# Altium project PreRegulator.PrjPcb
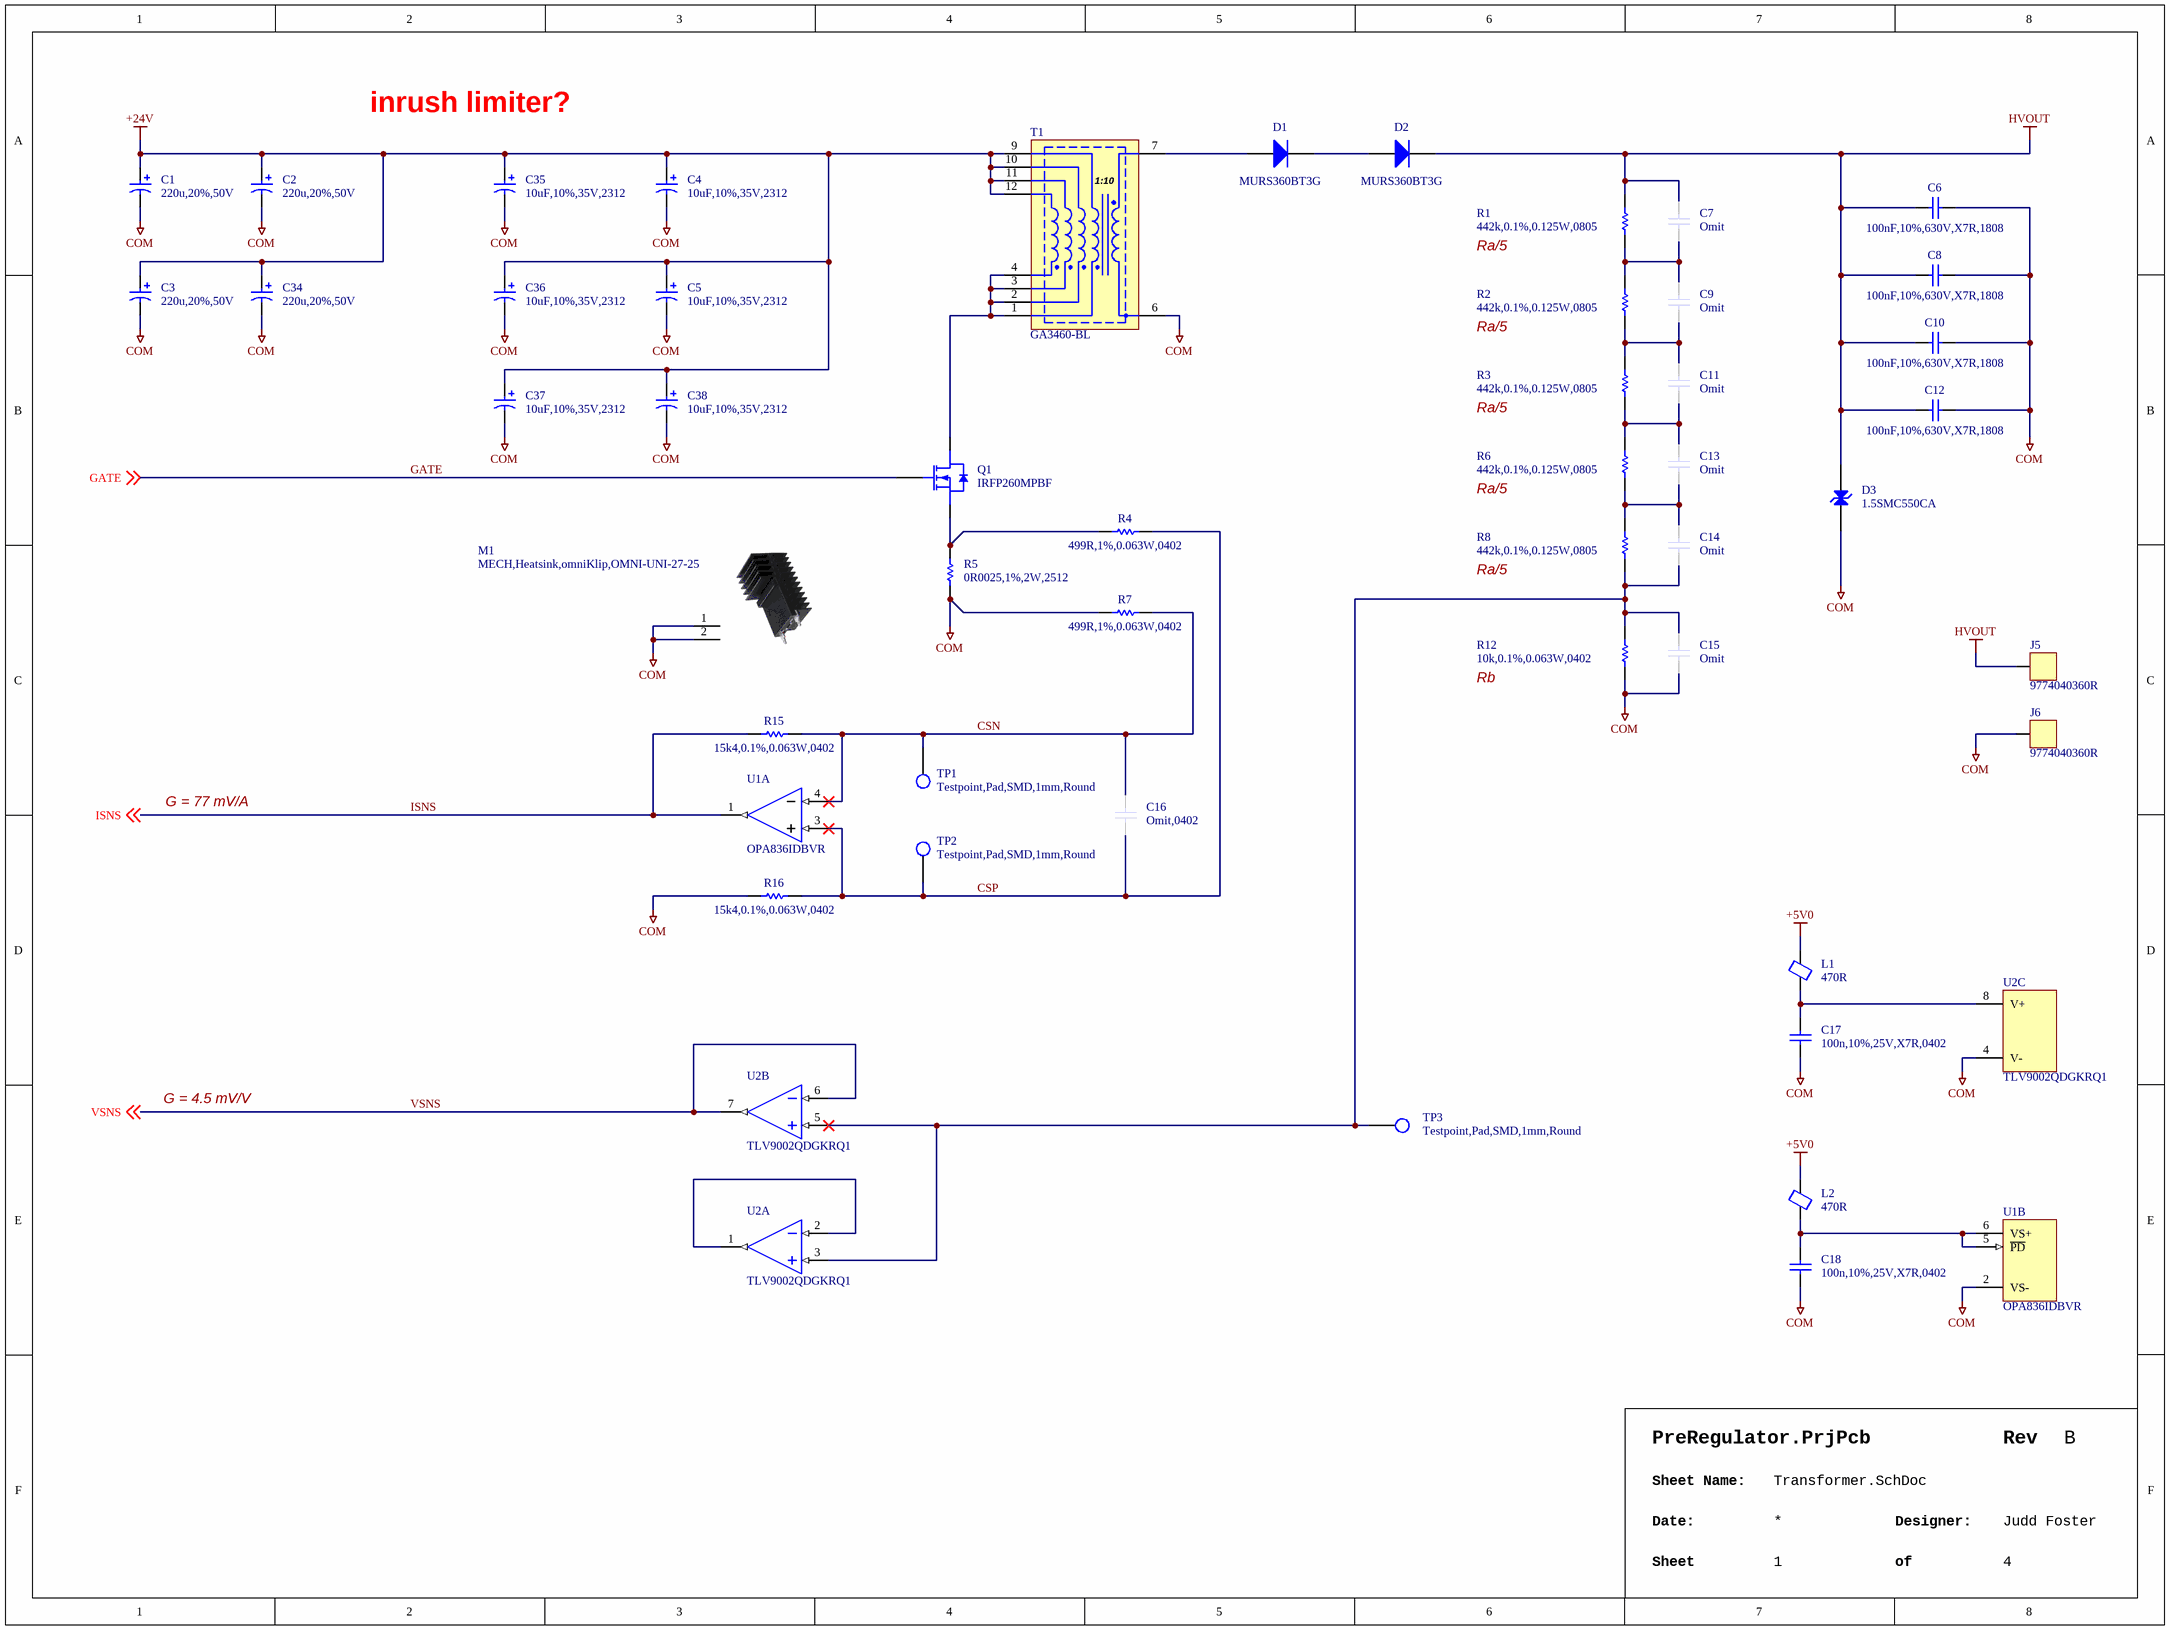
[diagram p0: Transformer.SchDoc]
Revision: B; Designer: Judd Foster
4 sheets, 110 parts. Net scope: global (net labels, ports and power ports of the same name join across sheets).
Board file: PreRegulator.PcbDoc
Sheets:
  Transformer.SchDoc
  Gate Driver.SchDoc
  Digital.SchDoc
  Power.SchDoc

## Sheet Transformer.SchDoc
size 406 x 304 mm; SheetNumber: 1; SheetTotal: 4

### Parts
C1  220u,20%,50V  [CAPPR500W60D1000H1600B]
C2  220u,20%,50V  [CAPPR500W60D1000H1600B]
C3  220u,20%,50V  [CAPPR500W60D1000H1600B]
C4  10uF,10%,35V,2312  [KYOCERA_PKG_TAJC]
C5  10uF,10%,35V,2312  [KYOCERA_PKG_TAJC]
C6  100nF,10%,630V,X7R,1808  [KEMET_PKG_LC]
C7  Omit  [CAPC_0805]  (no BOM)
C8  100nF,10%,630V,X7R,1808  [KEMET_PKG_LC]
C9  Omit  [CAPC_0805]  (no BOM)
C10  100nF,10%,630V,X7R,1808  [KEMET_PKG_LC]
C11  Omit  [CAPC_0805]  (no BOM)
C12  100nF,10%,630V,X7R,1808  [KEMET_PKG_LC]
C13  Omit  [CAPC_0805]  (no BOM)
C14  Omit  [CAPC_0805]  (no BOM)
C15  Omit  [CAPC_0805]  (no BOM)
C16  Omit,0402  [CAPC1005X06N]  (no BOM)
C17  100n,10%,25V,X7R,0402  [CAPC1005X06N]
C18  100n,10%,25V,X7R,0402  [CAPC1005X06N]
C34  220u,20%,50V  [CAPPR500W60D1000H1600B]
C35  10uF,10%,35V,2312  [KYOCERA_PKG_TAJC]
C36  10uF,10%,35V,2312  [KYOCERA_PKG_TAJC]
C37  10uF,10%,35V,2312  [KYOCERA_PKG_TAJC]
C38  10uF,10%,35V,2312  [KYOCERA_PKG_TAJC]
D1  MURS360BT3G  [ONSEMI_SMB]
D2  MURS360BT3G  [ONSEMI_SMB]
D3  1.5SMC550CA  [LITTELFUSE_DO-214AB]
J5  9774040360R  [WURTH_9774040360R]
J6  9774040360R  [WURTH_9774040360R]
L1  470R  [INDC1005X05N]
L2  470R  [INDC1005X05N]
M1  MECH,Heatsink,omniKlip,OMNI-UNI-27-25  [WAKEFIELD_OMNI-UNI-27-25]
Q1  IRFP260MPBF  [INFINEON_PKG_TO247AD]
R1  442k,0.1%,0.125W,0805  [RESC2012X07N]
R2  442k,0.1%,0.125W,0805  [RESC2012X07N]
R3  442k,0.1%,0.125W,0805  [RESC2012X07N]
R4  499R,1%,0.063W,0402  [RESC1005X04N]
R5  0R0025,1%,2W,2512  [RALEC_PKG_2512]
R6  442k,0.1%,0.125W,0805  [RESC2012X07N]
R7  499R,1%,0.063W,0402  [RESC1005X04N]
R8  442k,0.1%,0.125W,0805  [RESC2012X07N]
R12  10k,0.1%,0.063W,0402  [RESC1005X04N]
R15  15k4,0.1%,0.063W,0402  [RESC1005X04N]
R16  15k4,0.1%,0.063W,0402  [RESC1005X04N]
T1  GA3460-BL  [COILCRAFT_GA3460-BL]
TP1  Testpoint,Pad,SMD,1mm,Round  [TP100]
TP2  Testpoint,Pad,SMD,1mm,Round  [TP100]
TP3  Testpoint,Pad,SMD,1mm,Round  [TP100]
U1  OPA836IDBVR  [TEXASINSTRUMENTS_PKG_DBV0006A]  (parts A,B of 2)
U2  TLV9002QDGKRQ1  [SOP65P490X110-8]  (parts A,B,C of 3)

### Nets
+5V0: L1.2 L2.2
+24V: C1.1 C2.1 C3.1 C4.1 C5.1 C34.1 C35.1 C36.1 C37.1 C38.1 T1.9 T1.10 T1.11 T1.12
COM: C1.2 C2.2 C3.2 C4.2 C5.2 C6.1 C8.1 C10.1 C12.1 C15.1 C17.1 C18.1 C34.2 C35.2 C36.2 C37.2 C38.2 D3.2(A) J6.0(PIN) M1.1 M1.2 R5.1 R7.1 R12.1 R16.1 T1.6 U1.2(VS-) U2.4(V-)
HVOUT: C6.2 C7.2 C8.2 C10.2 C12.2 D2.1(K) D3.1(K) J5.0(PIN) R1.2
CSN: C16.1 R7.2 R15.2 TP1.1(TP) U1.4(VIN-)
CSP: C16.2 R4.2 R16.2 TP2.1(TP) U1.3(VIN+)
GATE: Q1.1(G) ; off-sheet GATE
ISNS: R15.1 U1.1(VOUT) ; off-sheet ISNS
VSNS: U2.6(IN2-) U2.7(OUT2) ; off-sheet VSNS
NetC7_1: C7.1 C9.2 R1.1 R2.2
NetC9_1: C9.1 C11.2 R2.1 R3.2
NetC11_1: C11.1 C13.2 R3.1 R6.2
NetC13_1: C13.1 C14.2 R6.1 R8.2
NetC14_1: C14.1 C15.2 R8.1 R12.2 TP3.1(TP) U2.3(IN1+) U2.5(IN2+)
NetC17_2: C17.2 L1.1 U2.8(V+)
NetC18_2: C18.2 L2.1 U1.5(~{PD}) U1.6(VS+)
NetD1_1: D1.1(K) D2.2(A)
NetD1_2: D1.2(A) T1.7
NetQ1_2: Q1.2(D) T1.1 T1.2 T1.3 T1.4
NetQ1_3: Q1.3(S) R4.1 R5.2
NetU2_1: U2.1(OUT1) U2.2(IN1-)

### Notes on the sheet
- inrush limiter?
- Ra/5
- Rb
- G = 77 mV/A
- G = 4.5 mV/V
- Rev
- Sheet Name:
- Date:
- Sheet
- Designer:
- of
- (in symbol XFR,Flyback,COILCRAFT_GA3460-BL) 1:10

### Library data of the parts
C1-C3 C34 = CAP,Alum,220uF,20%,50VDC,Radial,Thru: 220 ï¿½F 50 V Aluminum Electrolytic Capacitors Radial, Can 5000 Hrs @ 105ï¿½C; Manufacturer 1: Rubycon; Manufacturer 1 Part Number: 50YXG220MEFCT810X16; Vendor 1 Part Number: 1189-3771-1-ND; Vendor 1: Digikey; Part Name: CAP,Alum,220uF,20%,50VDC,Radial,Thru; CreatedBy: Judd Foster; HelpURL: https://www.rubycon.co.jp/wp-content/uploads/catalog-aluminum/YXG.pdf; Value: 220u
C4 C5 C35-C38 = CAP,Tant,10uF,10%,35V,2312: 10 ÂµF Molded Tantalum Capacitors 35 V 2312 (6032 Metric) 1.6Ohm; Manufacturer 1: KYOCERA AVX; Manufacturer 1 Part Number: TAJC106K035RNJ; Vendor 1 Part Number: 478-1701-1-ND; Vendor 1: DigiKey; Part Name: CAP,Tant,10uF,10%,35V,2312; CreatedBy: Judd Foster; HelpURL: https://datasheets.kyocera-avx.com/TAJ.pdf
C6 C8 C10 C12 = CAP,Cer,100nF,10%,630V,X7R,1808: 0.1 ÂµF Â±10% 630V Ceramic Capacitor X7R 1808 (4520 Metric); Manufacturer 1: KEMET; Manufacturer 1 Part Number: C1808C104KBRAC7800; Vendor 1 Part Number: 399-C1808C104KBRAC7800CT-ND; Vendor 1: DigiKey; Part Name: CAP,Cer,100nF,10%,630V,X7R,1808; CreatedBy: Judd Foster; HelpURL: https://content.kemet.com/datasheets/KEM_C1010_X7R_HV_SMD.pdf; Value: 100nF
C7 C9 C11 C13-C15 = CAP,Omit,0805: Part Name: CAP,Omit,0805; CreatedBy: Judd Foster; HelpURL: N/A; Manufacturer 1: N/A; Manufacturer 1 Part Number: N/A; Vendor 1: N/A; Vendor 1 Part Number: N/A; Value: Omit
C16 = CAP,Omit,0402: Omit; Part Name: CAP,Omit,0402; CreatedBy: Judd Foster; HelpURL: N/A; Manufacturer 1: N/A; Manufacturer 1 Part Number: N/A; Vendor 1: N/A; Vendor 1 Part Number: N/A; Value: Omit
C17 C18 = CAP,Cer,100nF,10%,25V,X7R,0402: 0.1ï¿½F ï¿½10% 25V Ceramic Capacitor X7R 0402 (1005 Metric); Manufacturer 1: Murata Electronics; Manufacturer 1 Part Number: GRM155R71E104KE14J; Vendor 1 Part Number: 490-14603-1-ND; Vendor 1: DigiKey; Value: 100nF; Part Name: CAP,Cer,100nF,10%,25V,X7R,0402; CreatedBy: Judd Foster; HelpURL: https://search.murata.co.jp/Ceramy/image/img/A01X/G101/ENG/GRM155R71E104KE14-01.pdf
D1 D2 = Diode,Gen,600V,3A,SMB: Diode 600 V 3A Surface Mount SMB; Manufacturer 1: onsemi; Vendor 1 Part Number: MURS360BT3GOSCT-ND; Vendor 1: Digikey; Part Name: Diode,Gen,600V,3A,SMB; CreatedBy: Judd Foster; HelpURL: https://www.onsemi.com/pdf/datasheet/murs360bt3-d.pdf; Manufacturer 1 Part Number: MURS360BT3G
D3 = DIODE,TVS,495VWM,SMD: 760V Clamp 2A Ipp Tvs Diode Surface Mount DO-214AB (SMCJ); Manufacturer 1: Littelfuse Inc.; Vendor 1 Part Number: 1.5SMC550CACT-ND; Vendor 1: Digikey; Part Name: DIODE,TVS,495VWM,SMD; CreatedBy: Judd Foster; HelpURL: https://www.littelfuse.com/~/media/electronics/datasheets/tvs_diodes/littelfuse_tvs_diode_1_5smc_datasheet.pdf.pdf; Manufacturer 1 Part Number: 1.5SMC550CA
J5 J6 = Mech,Standoff,M3,4mm,SMD: Round Standoff Threaded M3x0.5 Steel 0.157" (4.00mm); Manufacturer 1: Wï¿½rth Elektronik; Vendor 1 Part Number: 732-5271-1-ND; Vendor 1: Digikey; Part Name: Mech,Standoff,M3,4mm,SMD; CreatedBy: Judd Foster; HelpURL: https://www.we-online.com/katalog/datasheet/9774040360R.pdf; Manufacturer 1 Part Number: 9774040360R
L1 L2 = Ferrite,470R@100MHz,0402: 470 Ohms @ 100 MHz 1 Power Line Ferrite Bead 0402 (1005 Metric) 1A 200mOhm; Manufacturer 1: Murata Electronics; Manufacturer 1 Part Number: BLM15PX471SN1D; Vendor 1 Part Number: 490-10662-1-ND; Vendor 1: Digikey; Part Name: Ferrite,470R@100MHz,0402; CreatedBy: Judd Foster; HelpURL: https://www.murata.com/en-us/products/productdata/8796740059166/ENFA0018.pdf; Value: 470R
M1 = MECH,Heatsink,omniKlip,OMNI-UNI-27-25: Heat Sink TO-220, TO-247, TO-264 Aluminum Board Level, Vertical; Manufacturer 1: Wakefield-Vette; Vendor 1 Part Number: 345-1567-ND; Vendor 1: DigiKey; Part Name: MECH,Heatsink,omniKlip,OMNI-UNI-27-25; CreatedBy: Judd Foster; HelpURL: https://wakefieldthermal.com/content/data_sheets/OMNIKLIP/omniKlip%20Wakefield%20Vette.pdf; Manufacturer 1 Part Number: OMNI-UNI-27-25
Q1 = MOSFET,N Ch,200V,50A,IRFP260MPBF: N-Channel 200 V 50A (Tc) 300W (Tc) Through Hole TO-247AC; Manufacturer 1: Infineon Technologies; Vendor 1 Part Number: IRFP260MPBF-ND; Vendor 1: DigiKey; Part Name: MOSFET,N Ch,200V,50A,IRFP260MPBF; CreatedBy: Judd Foster; HelpURL: https://www.infineon.com/dgdl/irfp260mpbf.pdf?fileId=5546d462533600a40153562894e91fe0; Manufacturer 1 Part Number: IRFP260MPBF
R1-R3 R6 R8 = RES,442k,0.1%,0.125W,0805: 442 kOhms Â±0.1% 0.125W, 1/8W Chip Resistor 0805 (2012 Metric) Automotive AEC-Q200 Thin Film; Manufacturer 1: Panasonic Electronic Components; Manufacturer 1 Part Number: ERA-6AEB4423V; Vendor 1 Part Number: P442KDACT-ND; Vendor 1: DigiKey; Part Name: RES,442k,0.1%,0.125W,0805; CreatedBy: Judd Foster; HelpURL: https://industrial.panasonic.com/cdbs/www-data/pdf/RDM0000/AOA0000C307.pdf; Value: 442k
R4 R7 = RES,499R,1%,0.063W,0402: 62.5mW Thick Film Resistors 50V Â±100ppm/â„ƒ Â±1% 499Î© 0402 Chip Resistor - Surface Mount ROHS; Manufacturer 1: YAGEO; Manufacturer 1 Part Number: RC0402FR-07499RL; Vendor 1 Part Number: C137970; Vendor 1: LCSC; Part Name: RES,499R,1%,0.063W,0402; CreatedBy: Judd Foster; HelpURL: https://lcsc.com/datasheet/lcsc_datasheet_2304140030_YAGEO-RC0402FR-07499RL_C137970.pdf
R5 = RES,0R0025,1%,2W,2512: 2W Â±1% 2.5mÎ© 2512 Chip Resistor - Surface Mount ROHS; Manufacturer 1: RALEC; Manufacturer 1 Part Number: C2681064; Vendor 1: LCSC; Part Name: RES,0R0025,1%,2W,2512; CreatedBy: Judd Foster; HelpURL: https://lcsc.com/datasheet/lcsc_datasheet_2412031558_RALEC-LR2512-22R0025F4_C2681064.pdf; Vendor 1 Part Number: C2681064
R12 = RES,10k,0.1%,0.063W,0402: 10 kOhms ï¿½0.1% 0.1W, 1/10W Chip Resistor 0402 (1005 Metric) Automotive AEC-Q200 Thin Film; Manufacturer 1: Stackpole Electronics Inc; Manufacturer 1 Part Number: RNCF0402BTE10K0; Vendor 1 Part Number: RNCF0402BTE10K0CT-ND; Vendor 1: Digikey; Part Name: RES,10k,0.1%,0.063W,0402; CreatedBy: Judd Foster; HelpURL: https://www.seielect.com/catalog/sei-rncf.pdf; Value: 10k
R15 R16 = RES,15k4,0.1%,0.063W,0402: 15.4 kOhms Â±0.1% 0.063W, 1/16W Chip Resistor 0402 (1005 Metric) Thin Film; Manufacturer 1: YAGEO; Manufacturer 1 Part Number: RT0402BRD0715K4L; Vendor 1 Part Number: YAG4177CT-ND; Vendor 1: DigiKey; Part Name: RES,15k4,0.1%,0.063W,0402; CreatedBy: Judd Foster; HelpURL: https://www.yageo.com/upload/media/product/app/datasheet/rchip/pyu-rt_1-to-0.01_rohs_l.pdf; Value: 15k4
T1 = XFR,Flyback,COILCRAFT_GA3460-BL: Audio Transformers / Signal Transformers GA3460 for LT3751 500V 50A; Vendor 1 Part Number: 994-GA3460-BL; Vendor 1: Mouser; Part Name: XFR,Flyback,COILCRAFT_GA3460-BL; CreatedBy: Judd Foster; HelpURL: https://www.mouser.ca/datasheet/2/597/ga3459-463457.pdf; Manufacturer 1: Coilcraft; Manufacturer 1 Part Number: GA3460-BL
TP1-TP3 = Testpoint,Pad,SMD: PCB Testpoint 1mm Round; Part Name: Testpoint,Pad,SMD; CreatedBy: Judd Foster; HelpURL: N/A; Manufacturer 1: N/A; Manufacturer 1 Part Number: N/A; Vendor 1: N/A; Vendor 1 Part Number: N/A
U1 = OPA836IDBVR: Voltage Feedback Amplifier 1 Circuit Rail-to-Rail SOT-23-6; Manufacturer 1: Texas Instruments; Vendor 1 Part Number: 296-44388-1-ND; Vendor 1: DigiKey; Part Name: OPA836IDBVR; CreatedBy: Judd Foster; HelpURL: https://www.ti.com/lit/ds/symlink/opa836.pdf?HQS=dis-dk-null-digikeymode-dsf-pf-null-wwe&ts=1741112370606&ref_url=https%253A%252F%252Fwww.ti.com%252Fgeneral%252Fdocs%252Fsuppproductinfo.tsp%253FdistId%253D10%2526gotoUrl%253Dhttps%253A%252F%252Fwww.ti.com%; Manufacturer 1 Part Number: OPA836IDBVR
U2 = TLV9002QDGKRQ1: General Purpose Amplifier Circuit Rail-to-Rail 8-VSSOP; Manufacturer 1: Texas Instruments; Vendor 1 Part Number: 296-TLV9002QDGKRQ1CT-ND; Vendor 1: Digikey; Part Name: TLV9002QDGKRQ1; CreatedBy: Judd Foster; HelpURL: https://www.ti.com/lit/ds/symlink/tlv9001-q1.pdf?ts=1702270446565&ref_url=https%253A%252F%252Fwww.google.com%252F; Manufacturer 1 Part Number: TLV9002QDGKRQ1

## Sheet Gate Driver.SchDoc
size 406 x 304 mm; SheetNumber: 2; SheetTotal: 4
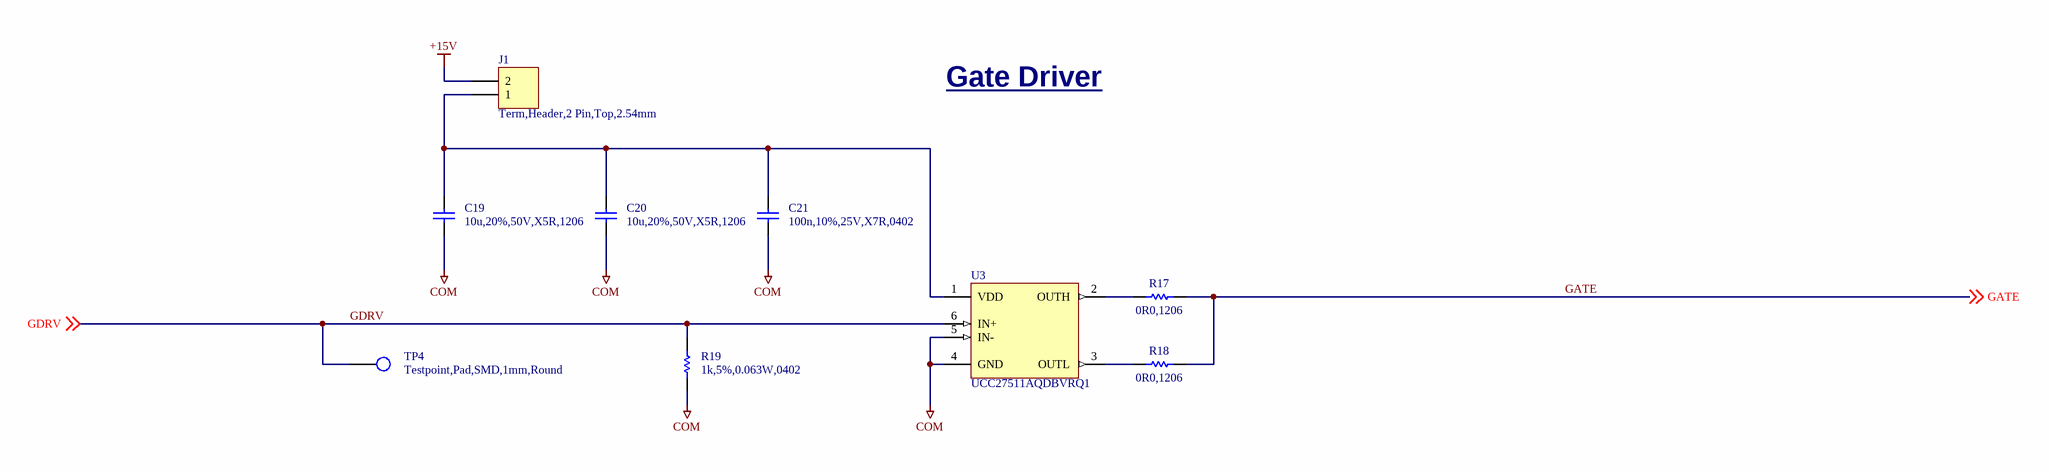
[diagram p1: Gate Driver.SchDoc]

### Parts
C19  10u,20%,50V,X5R,1206  [CAPC3216X16N]
C20  10u,20%,50V,X5R,1206  [CAPC3216X16N]
C21  100n,10%,25V,X7R,0402  [CAPC1005X06N]
J1  Term,Header,2 Pin,Top,2.54mm  [WURTH_61300211121]
R17  0R0,1206  [RESC3216X06N]
R18  0R0,1206  [RESC3216X06N]
R19  1k,5%,0.063W,0402  [RESC1005X04N]
TP4  Testpoint,Pad,SMD,1mm,Round  [TP100]
U3  UCC27511AQDBVRQ1  [SOTFL95P260X145-6]

### Nets
+15V: J1.2
COM: C19.1 C20.1 C21.1 R19.1 U3.4(GND) U3.5(IN-)
GATE: R17.2 R18.2 ; off-sheet GATE
GDRV: R19.2 TP4.1(TP) U3.6(IN+) ; off-sheet GDRV
NetC19_2: C19.2 C20.2 C21.2 J1.1 U3.1(VDD)
NetR17_1: R17.1 U3.2(OUTH)
NetR18_1: R18.1 U3.3(OUTL)

### Notes on the sheet
- Gate Driver
- Rev
- Sheet Name:
- Date:
- Sheet
- Designer:
- of

### Library data of the parts
C19 C20 = CAP,Cer,10uF,50VDC,X5R,1206: 10ï¿½F ï¿½20% 50V Ceramic Capacitor X5R 1206 (3216 Metric); Manufacturer 1: Samsung Electro-Mechanics; Manufacturer 1 Part Number: CL31A106MBHNNNE; Vendor 1 Part Number: 1276-6736-1-ND; Vendor 1: Digikey; Part Name: CAP,Cer,10uF,50VDC,X5R,1206; CreatedBy: Judd Foster; HelpURL: https://www.samsungsem.com/resources/file/global/support/product_catalog/MLCC.pdf; Value: 10u
C21 = CAP,Cer,100nF,10%,25V,X7R,0402: as C17 on sheet Transformer; Part Name: CAP,Cer,100nF,10%,25V,X7R,0402; CreatedBy: Judd Foster; HelpURL: https://search.murata.co.jp/Ceramy/image/img/A01X/G101/ENG/GRM155R71E104KE14-01.pdf
J1 = Term,Header,2 Pin,Top,2.54mm: Connector Header Through Hole 2 position 0.100" (2.54mm); Manufacturer 1: WÃ¼rth Elektronik; Manufacturer 1 Part Number: 61300211121; Vendor 1 Part Number: 732-5315-ND; Vendor 1: DigiKey; Part Name: Term,Header,2 Pin,Top,2.54mm; CreatedBy: Judd Foster; HelpURL: https://www.we-online.com/components/products/datasheet/61300211121.pdf
R17 R18 = RES,0R0,1206: 0 Ohms Jumper Chip Resistor 1206 (3216 Metric) Automotive AEC-Q200 Thick Film; Manufacturer 1: Stackpole Electronics Inc; Manufacturer 1 Part Number: RMCF1206ZT0R00; Vendor 1 Part Number: RMCF1206ZT0R00CT-ND; Vendor 1: Digikey; Value: 0R; Part Name: RES,0R0,1206; CreatedBy: Judd Foster; HelpURL: https://www.seielect.com/catalog/sei-rmcf_rmcp.pdf
R19 = RES,1k,5%,0.063W,0402: 1 kOhms ï¿½5% 0.063W, 1/16W Chip Resistor 0402 (1005 Metric) Automotive AEC-Q200 Thick Film; Manufacturer 1: Stackpole Electronics Inc; Manufacturer 1 Part Number: RMCF0402JT1K00; Vendor 1 Part Number: RMCF0402JT1K00CT-ND; Vendor 1: DIgikey; Part Name: RES,1k,5%,0.063W,0402; CreatedBy: Judd Foster; HelpURL: https://www.seielect.com/catalog/sei-rmcf_rmcp.pdf; Value: 1k
TP4 = Testpoint,Pad,SMD: PCB Testpoint 1mm Round; Part Name: Testpoint,Pad,SMD; CreatedBy: Judd Foster; HelpURL: N/A; Manufacturer 1: N/A; Manufacturer 1 Part Number: N/A; Vendor 1: N/A; Vendor 1 Part Number: N/A
U3 = UCC27511AQDBVRQ1: Gate Drivers Sngl-Ch high-Spd Low-Side Gate Driver; Manufacturer 1: Texas Instruments; Vendor 1 Part Number: 595-UCC27511AQDBVRQ1; Vendor 1: Mouser; Part Name: UCC27511AQDBVRQ1; CreatedBy: Judd Foster; HelpURL: https://www.ti.com/general/docs/suppproductinfo.tsp?distId=26&gotoUrl=https://www.ti.com/lit/gpn/ucc27511a-q1; Manufacturer 1 Part Number: UCC27511AQDBVRQ1

## Sheet Digital.SchDoc
size 406 x 304 mm; SheetNumber: 3; SheetTotal: 4
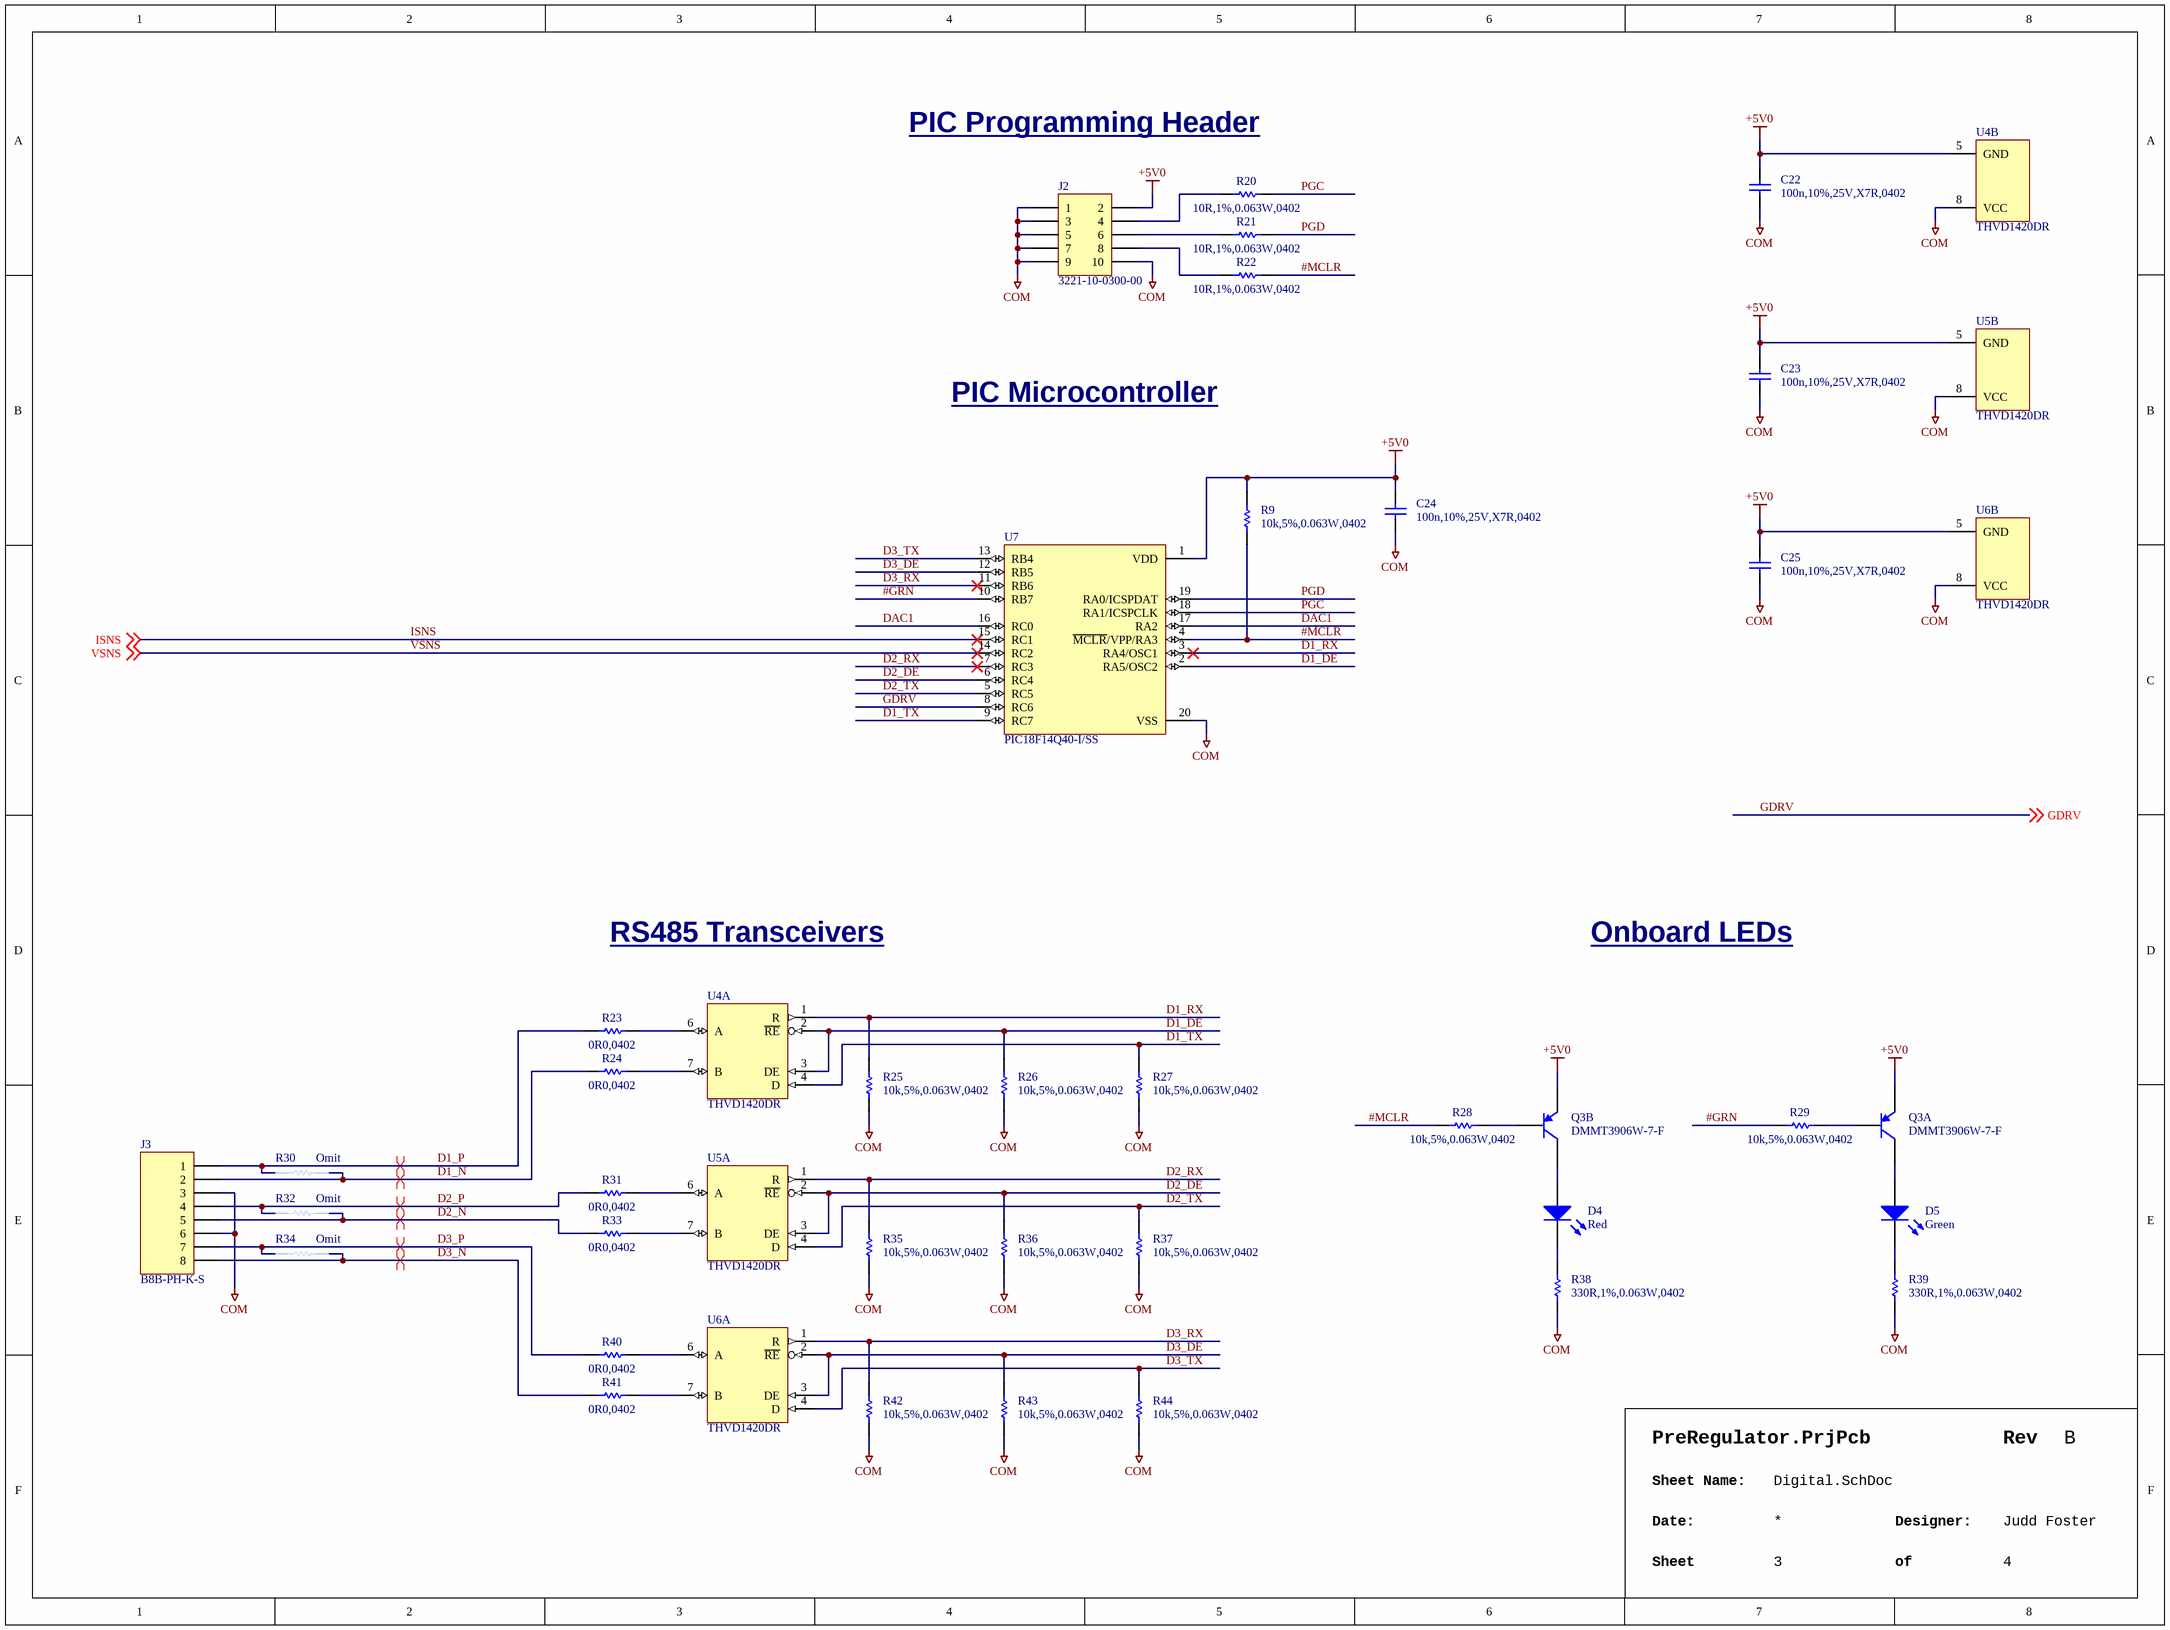
[diagram p2: Digital.SchDoc]

### Parts
C22  100n,10%,25V,X7R,0402  [CAPC1005X06N]
C23  100n,10%,25V,X7R,0402  [CAPC1005X06N]
C24  100n,10%,25V,X7R,0402  [CAPC1005X06N]
C25  100n,10%,25V,X7R,0402  [CAPC1005X06N]
D4  Red  [LITE-ON_LTST-C190KRKT]
D5  Green  [LITE-ON_LTST-C190KGKT]
J2  3221-10-0300-00  [CNC Tech_3221-10-0300-00]
J3  B8B-PH-K-S  [JST_B8B-PH-K-S]
Q3  DMMT3906W-7-F  [DIODES_SOT363]  (parts A,B of 2)
R9  10k,5%,0.063W,0402  [RESC1005X04N]
R20  10R,1%,0.063W,0402  [RESC1005X04N]
R21  10R,1%,0.063W,0402  [RESC1005X04N]
R22  10R,1%,0.063W,0402  [RESC1005X04N]
R23  0R0,0402  [RESC1005X04N]
R24  0R0,0402  [RESC1005X04N]
R25  10k,5%,0.063W,0402  [RESC1005X04N]
R26  10k,5%,0.063W,0402  [RESC1005X04N]
R27  10k,5%,0.063W,0402  [RESC1005X04N]
R28  10k,5%,0.063W,0402  [RESC1005X04N]
R29  10k,5%,0.063W,0402  [RESC1005X04N]
R30  Omit  [RESC3216X06N]  (no BOM)
R31  0R0,0402  [RESC1005X04N]
R32  Omit  [RESC3216X06N]  (no BOM)
R33  0R0,0402  [RESC1005X04N]
R34  Omit  [RESC3216X06N]  (no BOM)
R35  10k,5%,0.063W,0402  [RESC1005X04N]
R36  10k,5%,0.063W,0402  [RESC1005X04N]
R37  10k,5%,0.063W,0402  [RESC1005X04N]
R38  330R,1%,0.063W,0402  [RESC1005X04N]
R39  330R,1%,0.063W,0402  [RESC1005X04N]
R40  0R0,0402  [RESC1005X04N]
R41  0R0,0402  [RESC1005X04N]
R42  10k,5%,0.063W,0402  [RESC1005X04N]
R43  10k,5%,0.063W,0402  [RESC1005X04N]
R44  10k,5%,0.063W,0402  [RESC1005X04N]
U4  THVD1420DR  [TEXASINSTRUMENTS_PKG_D0008A]  (parts A,B of 2)
U5  THVD1420DR  [TEXASINSTRUMENTS_PKG_D0008A]  (parts A,B of 2)
U6  THVD1420DR  [TEXASINSTRUMENTS_PKG_D0008A]  (parts A,B of 2)
U7  PIC18F14Q40-I/SS  [MICROCHIP_PKG_SSOP20(C04-2072B)]

### Nets
+5V0: C22.2 C23.2 C24.2 C25.2 J2.2 Q3.4(E1) Q3.5(E2) R9.2 U4.5(GND) U5.5(GND) U6.5(GND) U7.1(VDD)
COM: C22.1 C23.1 C24.1 C25.1 J2.1 J2.3 J2.5 J2.7 J2.9 J2.10 J3.3 J3.6 R25.2 R26.2 R27.2 R35.2 R36.2 R37.2 R38.1 R39.1 R42.2 R43.2 R44.2 U4.8(VCC) U5.8(VCC) U6.8(VCC) U7.20(VSS)
#GRN: R29.2 U7.10(RB7)
#MCLR: R9.1 R22.2 R28.2 U7.4(~{MCLR}/VPP/RA3)
D1_DE: R26.1 U4.2(~{RE}) U4.3(DE) U7.2(RA5/OSC2)
D1_N: J3.2 R24.1 R30.1
D1_P: J3.1 R23.1 R30.2
D1_RX: R25.1 U4.1(R) U7.3(RA4/OSC1)
D1_TX: R27.1 U4.4(D) U7.9(RC7)
D2_DE: R36.1 U5.2(~{RE}) U5.3(DE) U7.6(RC4)
D2_N: J3.5 R32.1 R33.1
D2_P: J3.4 R31.1 R32.2
D2_RX: R35.1 U5.1(R) U7.7(RC3)
D2_TX: R37.1 U5.4(D) U7.5(RC5)
D3_DE: R43.1 U6.2(~{RE}) U6.3(DE) U7.12(RB5)
D3_N: J3.8 R34.1 R41.1
D3_P: J3.7 R34.2 R40.1
D3_RX: R42.1 U6.1(R) U7.11(RB6)
D3_TX: R44.1 U6.4(D) U7.13(RB4)
DAC1: U7.16(RC0) U7.17(RA2)
GDRV: U7.8(RC6) ; off-sheet GDRV
ISNS: U7.15(RC1) ; off-sheet ISNS
PGC: R20.2 U7.18(RA1/ICSPCLK)
PGD: R21.2 U7.19(RA0/ICSPDAT)
VSNS: U7.14(RC2) ; off-sheet VSNS
NetD4_A: D4.A Q3.6(C2)
NetD4_C: D4.C R38.2
NetD5_A: D5.A Q3.3(C1)
NetD5_C: D5.C R39.2
NetJ2_4: J2.4 R20.1
NetJ2_6: J2.6 R21.1
NetJ2_8: J2.8 R22.1
NetQ3_1: Q3.1(B2) R28.1
NetQ3_2: Q3.2(B1) R29.1
NetR23_2: R23.2 U4.6(A)
NetR24_2: R24.2 U4.7(B)
NetR31_2: R31.2 U5.6(A)
NetR33_2: R33.2 U5.7(B)
NetR40_2: R40.2 U6.6(A)
NetR41_2: R41.2 U6.7(B)

### Layout directives
differential pair: D1_N, D1_P, D2_N, D2_P, D3_N, D3_P

### Notes on the sheet
- PIC Programming Header
- PIC Microcontroller
- RS485 Transceivers
- Onboard LEDs
- Rev
- Sheet Name:
- Date:
- Sheet
- Designer:
- of

### Library data of the parts
C22-C25 = CAP,Cer,100nF,10%,25V,X7R,0402: as C17 on sheet Transformer; Part Name: CAP,Cer,100nF,10%,25V,X7R,0402; CreatedBy: Judd Foster; HelpURL: https://search.murata.co.jp/Ceramy/image/img/A01X/G101/ENG/GRM155R71E104KE14-01.pdf
D4 = LED,Red,SMD,0603: Red 631nm LED Indication - Discrete 2V 0603 (1608 Metric); Manufacturer 1: Lite-On Inc.; Manufacturer 1 Part Number: LTST-C190KRKT; Vendor 1 Part Number: 160-1436-1-ND; Vendor 1: Digikey; Part Name: LED,Red,SMD,0603; CreatedBy: Judd Foster; HelpURL: https://optoelectronics.liteon.com/upload/download/DS-22-99-0151/LTST-C190KRKT.pdf; Value: Red
D5 = LED,Green,SMD,0603: Green 571nm LED Indication - Discrete 2V 0603 (1608 Metric); Manufacturer 1: Lite-On Inc.; Manufacturer 1 Part Number: LTST-C190KGKT; Vendor 1 Part Number: 160-1435-1-ND; Vendor 1: Digikey; Part Name: LED,Green,SMD,0603; CreatedBy: Judd Foster; HelpURL: https://optoelectronics.liteon.com/upload/download/DS22-2000-074/LTST-C190KGKT.PDF; Value: Green
J2 = Term,Header,5x2 Pin,Shroud,1.27mm,SMD: Connector Header Surface Mount 10 position 0.050" (1.27mm); Manufacturer 1: CNC Tech; Vendor 1 Part Number: 1175-1735-ND; Vendor 1: Digikey; Part Name: Term,Header,5x2 Pin,Shroud,1.27mm,SMD; CreatedBy: Judd Foster; HelpURL: http://www.cnctech.us/pdfs/3221-XX-0300-00_.pdf; Manufacturer 1 Part Number: 3221-10-0300-00
J3 = CONN,JST,8 Pin,2mm,Vert,Thru: Connector Header Through Hole 8 position 0.079" (2.00mm); Manufacturer 1: JST Sales America Inc.; Vendor 1 Part Number: 455-1710-ND; Vendor 1: DigiKey; Part Name: CONN,JST,8 Pin,2mm,Vert,Thru; CreatedBy: Judd Foster; HelpURL: https://www.jst-mfg.com/product/pdf/eng/ePH.pdf; Manufacturer 1 Part Number: B8B-PH-K-S
Q3 = Trans,PNP,Dual,40V,200mA,SOT363: Bipolar (BJT) Transistor Array 2 PNP (Dual) Matched Pair 40V 200mA 250MHz 200mW Surface Mount SOT-363; Manufacturer 1: Diodes Incorporated; Vendor 1 Part Number: DMMT3906W-FDICT-ND; Vendor 1: Digikey; Part Name: Trans,PNP,Dual,40V,200mA,SOT363; CreatedBy: Judd Foster; HelpURL: https://www.diodes.com/assets/Datasheets/ds30312.pdf; Manufacturer 1 Part Number: DMMT3906W-7-F
R9 R25-R29 R35-R37 R42-R44 = RES,10k,5%,0.063W,0402: 10 kOhms ï¿½5% 0.063W, 1/16W Chip Resistor 0402 (1005 Metric) Automotive AEC-Q200 Thick Film; Manufacturer 1: Stackpole Electronics Inc; Manufacturer 1 Part Number: RMCF0402JT10K0; Vendor 1 Part Number: RMCF0402JT10K0CT-ND; Vendor 1: DIgikey; Part Name: RES,10k,5%,0.063W,0402; CreatedBy: Judd Foster; HelpURL: https://www.seielect.com/catalog/sei-rmcf_rmcp.pdf; Value: 10k
R20-R22 = RES,10R,1%,0.063W,0402: 10 Ohms ï¿½1% 0.063W, 1/16W Chip Resistor 0402 (1005 Metric) Automotive AEC-Q200 Thick Film; Manufacturer 1: Panasonic Electronic Components; Manufacturer 1 Part Number: ERJ-2RKF10R0X; Vendor 1 Part Number: P10.0LCT-ND; Vendor 1: Digikey; Part Name: RES,10R,1%,0.063W,0402; CreatedBy: Judd Foster; HelpURL: https://industrial.panasonic.com/cdbs/www-data/pdf/RDA0000/AOA0000C304.pdf; Value: 10R
R23 R24 R31 R33 R40 R41 = RES,0R0,0402: 0 Ohms Jumper 0.1W, 1/10W Chip Resistor 0402 (1005 Metric) Automotive AEC-Q200 Thick Film; Manufacturer 1: Panasonic Electronic Components; Manufacturer 1 Part Number: ERJ-2GE0R00X; Vendor 1 Part Number: P0.0JCT-ND; Vendor 1: Digikey; Value: 0R; Part Name: RES,0R0,0402; CreatedBy: Judd Foster; HelpURL: https://industrial.panasonic.com/cdbs/www-data/pdf/RDA0000/AOA0000C301.pdf
R30 R32 R34 = RES,Omit,1206: Part Name: RES,Omit,1206; CreatedBy: Judd Foster; HelpURL: N/A; Manufacturer 1: N/A; Manufacturer 1 Part Number: N/A; Vendor 1: N/A; Vendor 1 Part Number: N/A; Value: Omit
R38 R39 = RES,330R,1%,0.063W,0402: 330 Ohms Â±1% 0.063W, 1/16W Chip Resistor 0402 (1005 Metric) Moisture Resistant Thick Film; Manufacturer 1: YAGEO; Manufacturer 1 Part Number: RC0402FR-07330RL; Vendor 1 Part Number: 311-330LRCT-ND; Vendor 1: DigiKey; Part Name: RES,330R,1%,0.063W,0402; CreatedBy: Judd Foster; HelpURL: https://www.yageo.com/upload/media/product/products/datasheet/rchip/PYu-RC_Group_51_RoHS_L_12.pdf; Value: 330R
U4-U6 = THVD1420DR: 1/1 Transceiver Half RS422, RS485 8-SOIC; Manufacturer 1: Texas Instruments; Vendor 1 Part Number: 296-THVD1420DRCT-ND; Vendor 1: DigiKey; Part Name: THVD1420DR; CreatedBy: Judd Foster; HelpURL: https://www.ti.com/lit/ds/symlink/thvd1420.pdf?HQS=dis-dk-null-digikeymode-dsf-pf-null-wwe&ts=1735314435967; Manufacturer 1 Part Number: THVD1420DR
U7 = PIC18F14Q40-I_SS: PIC PICÂ® 18F Microcontroller IC 8-Bit 64MHz 16KB (16K x 8) FLASH 20-SSOP; Manufacturer 1: Microchip Technology; Vendor 1 Part Number: 150-PIC18F14Q40-I/SS-ND; Vendor 1: DigiKey; Part Name: PIC18F14Q40-I_SS; CreatedBy: Judd Foster; HelpURL: https://ww1.microchip.com/downloads/en/DeviceDoc/PIC18F04-05-14-15-Q40-1420-Pin-Low-Power-High-Performance-Microcontroller-With-XLP-Technology-Data-Sheet-40002236B.pdf; Manufacturer 1 Part Number: PIC18F14Q40-I/SS

## Sheet Power.SchDoc
size 406 x 304 mm; SheetNumber: 4; SheetTotal: 4
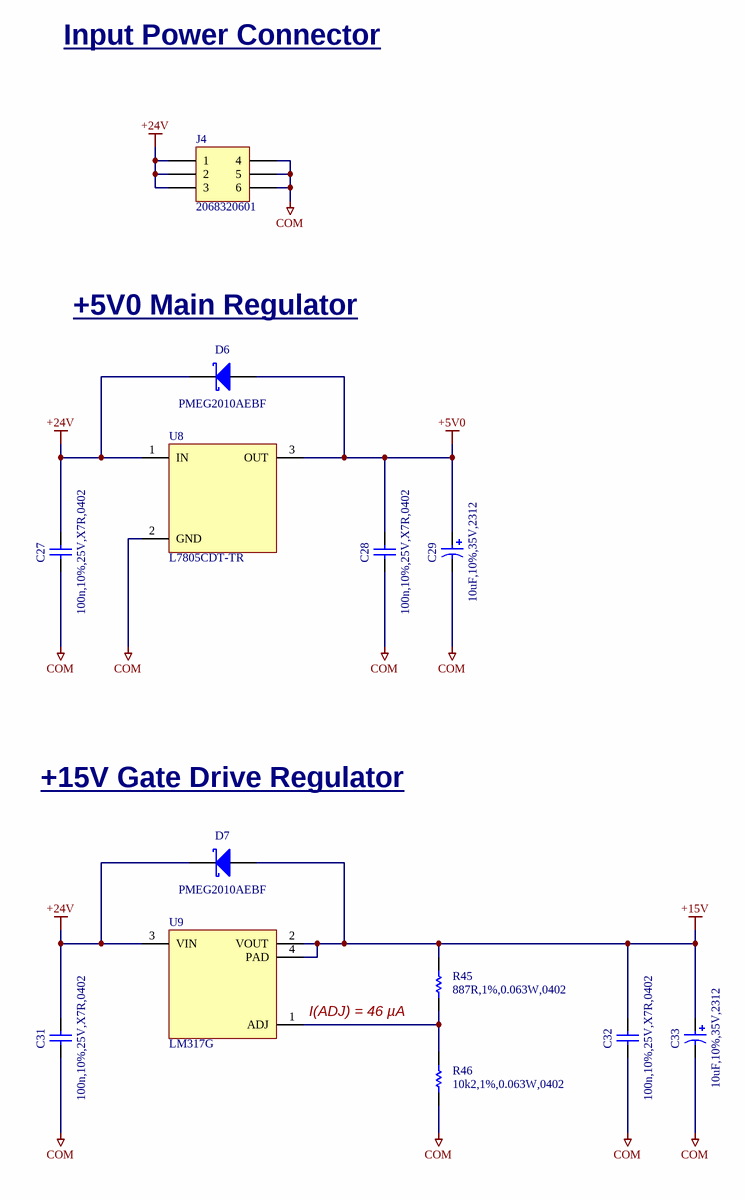
[diagram p3: Power.SchDoc]

### Parts
C27  100n,10%,25V,X7R,0402  [CAPC1005X06N]
C28  100n,10%,25V,X7R,0402  [CAPC1005X06N]
C29  10uF,10%,35V,2312  [KYOCERA_PKG_TAJC]
C31  100n,10%,25V,X7R,0402  [CAPC1005X06N]
C32  100n,10%,25V,X7R,0402  [CAPC1005X06N]
C33  10uF,10%,35V,2312  [KYOCERA_PKG_TAJC]
D6  PMEG2010AEBF  [NEXPERIA_PKG_SOD523]
D7  PMEG2010AEBF  [NEXPERIA_PKG_SOD523]
J4  2068320601  [MOLEX_2068320601]
R45  887R,1%,0.063W,0402  [RESC1005X04N]
R46  10k2,1%,0.063W,0402  [RESC1005X04N]
U8  L7805CDT-TR  [STMICRO_L7805CDT-TR]
U9  LM317G  [UMW_PKG_SOT223-3L]

### Nets
+5V0: C28.2 C29.1 D6.2(A) U8.3(OUT)
+15V: C32.2 C33.1 D7.2(A) R45.2 U9.2(VOUT) U9.4(PAD)
+24V: C27.2 C31.2 D6.1(K) D7.1(K) J4.1 J4.2 J4.3 U8.1(IN) U9.3(VIN)
COM: C27.1 C28.1 C29.2 C31.1 C32.1 C33.2 J4.4 J4.5 J4.6 R46.1 U8.2(GND)
NetR45_1: R45.1 R46.2 U9.1(ADJ)

### Notes on the sheet
- Input Power Connector
- +5V0 Main Regulator
- +15V Gate Drive Regulator
- I(ADJ) = 46 µA
- Rev
- Sheet Name:
- Date:
- Sheet
- Designer:
- of

### Library data of the parts
C27 C28 C31 C32 = CAP,Cer,100nF,10%,25V,X7R,0402: as C17 on sheet Transformer; Part Name: CAP,Cer,100nF,10%,25V,X7R,0402; CreatedBy: Judd Foster; HelpURL: https://search.murata.co.jp/Ceramy/image/img/A01X/G101/ENG/GRM155R71E104KE14-01.pdf
C29 C33 = CAP,Tant,10uF,10%,35V,2312: as C4 on sheet Transformer; Part Name: CAP,Tant,10uF,10%,35V,2312; CreatedBy: Judd Foster; HelpURL: https://datasheets.kyocera-avx.com/TAJ.pdf
D6 D7 = DIODE,Schottky,20V,1A,SOD523: Diode 20 V 1A Surface Mount SOD-523; Manufacturer 1: Nexperia USA Inc.; Vendor 1 Part Number: 1727-8539-1-ND; Vendor 1: DigiKey; Part Name: DIODE,Schottky,20V,1A,SOD523; CreatedBy: Judd Foster; HelpURL: https://assets.nexperia.com/documents/data-sheet/PMEG2010AEB.pdf; Manufacturer 1 Part Number: PMEG2010AEBF
J4 = Conn,Micro-Fit,Hdr,6Pos,Vert,Thru: Connector Header Through Hole 6 position 0.118" (3.00mm); Manufacturer 1: Molex; Vendor 1 Part Number: WM26556-ND; Vendor 1: DigiKey; Part Name: Conn,Micro-Fit,Hdr,6Pos,Vert,Thru; CreatedBy: Judd Foster; HelpURL: https://www.molex.com/en-us/products/part-detail/2068320601?display=pdf; Manufacturer 1 Part Number: 2068320601
R45 = RES,887R,1%,0.063W,0402: 887Î© 62.5mW 50V Â±200ppm/â„ƒ Â±1% Thick Film Resistors 0402 Chip Resistor - Surface Mount ROHS; Manufacturer 1: FH (Guangdong Fenghua Advanced Tech); Manufacturer 1 Part Number: RC-02W8870FT; Vendor 1 Part Number: C321640; Vendor 1: LCSC; Part Name: RES,887R,1%,0.063W,0402; CreatedBy: Judd Foster; HelpURL: https://www.lcsc.com/datasheet/lcsc_datasheet_2411220041_FH--Guangdong-Fenghua-Advanced-Tech-RC-02W8870FT_C321640.pdf
R46 = RES,10k2,1%,0.063W,0402: 10.2 kOhms Â±1% 0.063W, 1/16W Chip Resistor 0402 (1005 Metric) Moisture Resistant Thick Film; Manufacturer 1: YAGEO; Manufacturer 1 Part Number: RC0402FR-0710K2L; Vendor 1 Part Number: YAG2950CT-ND; Vendor 1: DigiKey; Part Name: RES,10k2,1%,0.063W,0402; CreatedBy: Judd Foster; HelpURL: https://www.yageo.com/upload/media/product/products/datasheet/rchip/PYu-RC_Group_51_RoHS_L_12.pdf; Value: 10k2
U8 = L7805CDT-TR: 62dB@(120Hz) 1.5A Fixed 5V Positive electrode 35V DPAK Voltage Regulators - Linear, Low Drop Out (LDO) Regulators ROHS; Manufacturer 1: STMicroelectronics; Vendor 1 Part Number: C310413; Vendor 1: LCSC; Part Name: L7805CDT-TR; CreatedBy: Judd Foster; HelpURL: https://lcsc.com/datasheet/lcsc_datasheet_2304140030_STMicroelectronics-L7805CDT-TR_C310413.pdf; Manufacturer 1 Part Number: L7805CDT-TR
U9 = LM317G: 75dB@(120Hz) 2.2A Adjustable 1.2V~37V Positive electrode 40V SOT-223 Voltage Regulators - Linear, Low Drop Out (LDO) Regulators ROHS; Manufacturer 1: UMW(Youtai Semiconductor Co., Ltd.); Vendor 1 Part Number: C347367; Vendor 1: LCSC; Part Name: LM317G; CreatedBy: Judd Foster; HelpURL: https://www.lcsc.com/datasheet/lcsc_datasheet_2411131159_UMW-Youtai-Semiconductor-Co---Ltd--LM317G_C347367.pdf; Manufacturer 1 Part Number: LM317G

## Nets that join several sheets
+5V0: Transformer (L1.2 L2.2), Digital (12 pins), Power (C28.2 C29.1 D6.2 U8.3)
+15V: Gate Driver (J1.2), Power (6 pins)
+24V: Transformer (14 pins), Power (9 pins)
COM: Transformer (28 pins), Gate Driver (6 pins), Digital (27 pins), Power (11 pins)
GATE: Transformer (Q1.1), Gate Driver (R17.2 R18.2)
GDRV: Gate Driver (R19.2 TP4.1 U3.6), Digital (U7.8)
ISNS: Transformer (R15.1 U1.1), Digital (U7.15)
VSNS: Transformer (U2.6 U2.7), Digital (U7.14)